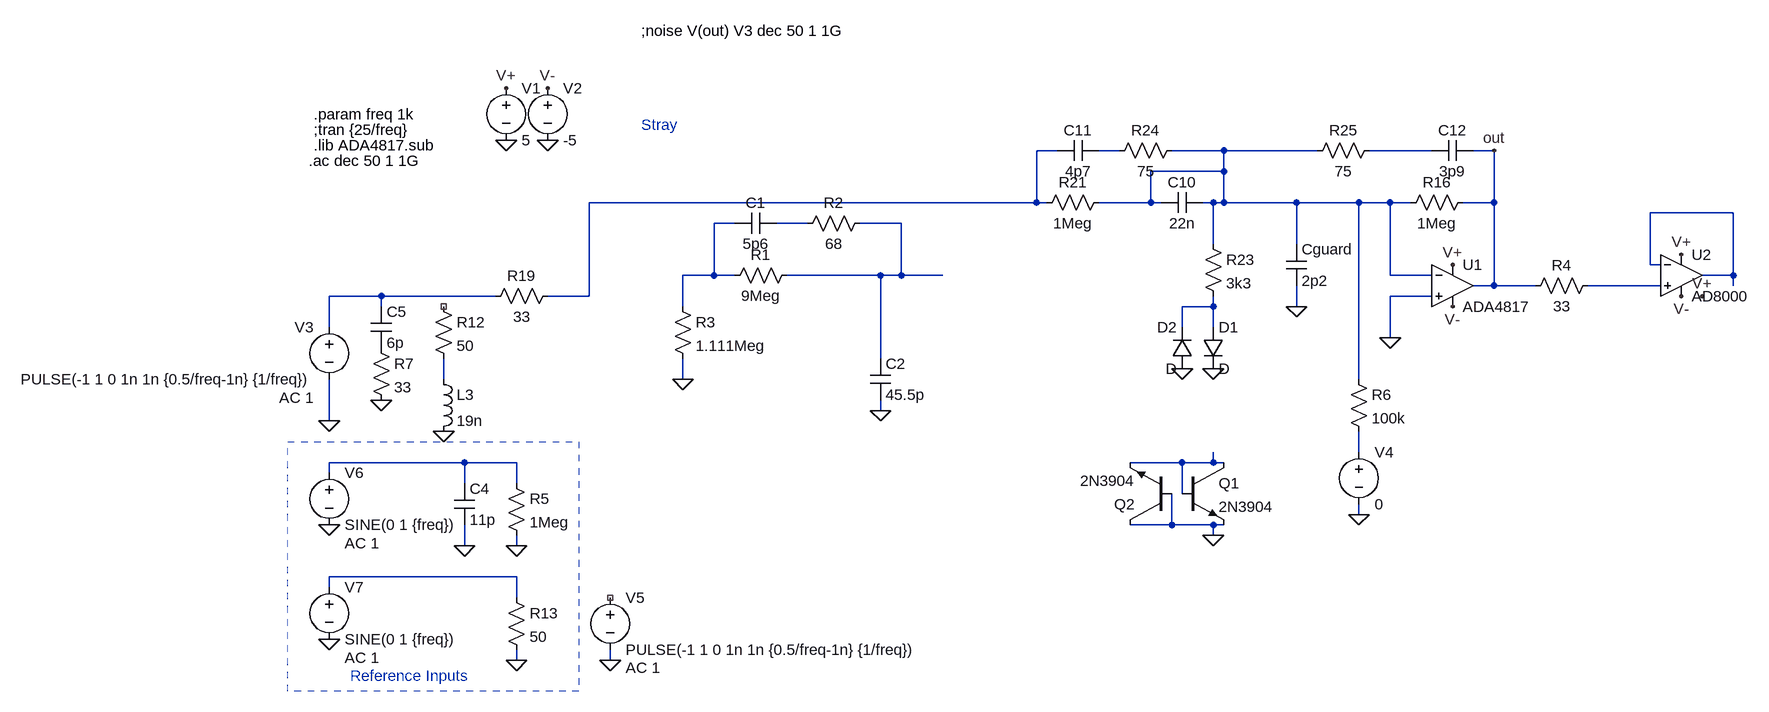
[diagram p0: schematic input-inverting.asc]
input-inverting.asc, the LTspice schematic file:
Version 4
SHEET 1 2588 772
WIRE 976 -208 944 -208
WIRE 1072 -208 1040 -208
WIRE 1232 -208 1152 -208
WIRE 1376 -208 1232 -208
WIRE 1552 -208 1456 -208
WIRE 1648 -208 1616 -208
WIRE 1232 -176 1232 -208
WIRE 1232 -176 1120 -176
WIRE 944 -128 944 -208
WIRE 944 -128 256 -128
WIRE 960 -128 944 -128
WIRE 1120 -128 1120 -176
WIRE 1120 -128 1040 -128
WIRE 1136 -128 1120 -128
WIRE 1216 -128 1200 -128
WIRE 1232 -128 1232 -176
WIRE 1232 -128 1216 -128
WIRE 1344 -128 1232 -128
WIRE 1440 -128 1344 -128
WIRE 1488 -128 1440 -128
WIRE 1520 -128 1488 -128
WIRE 1648 -128 1648 -208
WIRE 1648 -128 1600 -128
WIRE 2016 -112 1888 -112
WIRE 480 -96 448 -96
WIRE 592 -96 544 -96
WIRE 736 -96 672 -96
WIRE 1216 -64 1216 -128
WIRE 1344 -64 1344 -128
WIRE 1888 -32 1888 -112
WIRE 1904 -32 1888 -32
WIRE 448 -16 448 -96
WIRE 448 -16 400 -16
WIRE 480 -16 448 -16
WIRE 704 -16 560 -16
WIRE 736 -16 736 -96
WIRE 736 -16 704 -16
WIRE 800 -16 736 -16
WIRE 1488 -16 1488 -128
WIRE 1552 -16 1488 -16
WIRE 2016 -16 2016 -112
WIRE 2016 -16 1968 -16
WIRE 1648 0 1648 -128
WIRE 1648 0 1616 0
WIRE 1712 0 1648 0
WIRE 1904 0 1792 0
WIRE 2016 0 2016 -16
WIRE -64 16 -144 16
WIRE 112 16 -64 16
WIRE 256 16 256 -128
WIRE 256 16 192 16
WIRE 1552 16 1488 16
WIRE -64 32 -64 16
WIRE 400 32 400 -16
WIRE 1216 32 1216 16
WIRE 1216 32 1168 32
WIRE 1344 32 1344 0
WIRE -144 64 -144 16
WIRE 1168 64 1168 32
WIRE 1216 64 1216 32
WIRE 1488 80 1488 16
WIRE 704 112 704 -16
WIRE 32 144 32 112
WIRE 400 144 400 112
WIRE 1440 144 1440 -128
WIRE 704 192 704 176
WIRE -144 208 -144 144
WIRE 1440 256 1440 224
WIRE 64 272 -144 272
WIRE 144 272 64 272
WIRE 1168 272 1088 272
WIRE 1216 272 1216 256
WIRE 1216 272 1168 272
WIRE 1232 272 1216 272
WIRE -144 288 -144 272
WIRE 64 304 64 272
WIRE 144 304 144 272
WIRE 1168 320 1168 272
WIRE 1440 352 1440 336
WIRE 1152 368 1152 320
WIRE 1152 368 1088 368
WIRE 1216 368 1152 368
WIRE 1232 368 1216 368
WIRE 1216 384 1216 368
WIRE 64 400 64 368
WIRE 144 400 144 384
WIRE 144 448 -144 448
WIRE -144 464 -144 448
WIRE 144 480 144 448
WIRE 144 576 144 560
WIRE 288 576 288 560
FLAG 128 -224 0
FLAG 128 -304 V+
FLAG 1584 -32 V+
FLAG 192 -224 0
FLAG 192 -304 V-
FLAG 1584 32 V-
FLAG -144 208 0
FLAG -144 368 0
FLAG 64 400 0
FLAG 144 400 0
FLAG -64 176 0
FLAG -144 544 0
FLAG 144 576 0
FLAG 32 224 0
FLAG 1936 -48 V+
FLAG 1968 16 V+
FLAG 1936 16 V-
FLAG 288 576 0
FLAG 1488 80 0
FLAG 1216 384 0
FLAG 704 192 0
FLAG 400 144 0
FLAG 1440 352 0
FLAG 1344 32 0
FLAG 1648 -208 out
FLAG 1168 128 0
FLAG 1216 128 0
SYMBOL Opamps\\opamp2 1584 -64 R0
SYMATTR InstName U1
SYMATTR Value ADA4817
SYMBOL voltage 128 -320 R0
WINDOW 123 0 0 Left 2
WINDOW 39 0 0 Left 2
SYMATTR InstName V1
SYMATTR Value 5
SYMBOL voltage 192 -320 R0
WINDOW 123 0 0 Left 2
WINDOW 39 0 0 Left 2
SYMATTR InstName V2
SYMATTR Value -5
SYMBOL voltage 288 464 R0
WINDOW 123 24 124 Left 2
WINDOW 39 0 0 Left 2
SYMATTR Value2 AC 1
SYMATTR InstName V5
SYMATTR Value PULSE(-1 1 0 1n 1n {0.5/freq-1n} {1/freq})
SYMBOL voltage -144 272 R0
WINDOW 123 24 124 Left 2
WINDOW 39 0 0 Left 2
SYMATTR Value2 AC 1
SYMATTR InstName V6
SYMATTR Value SINE(0 1 {freq})
SYMBOL cap 48 304 R0
SYMATTR InstName C4
SYMATTR Value 11p
SYMBOL res 128 288 R0
SYMATTR InstName R5
SYMATTR Value 1Meg
SYMBOL cap -80 32 R0
SYMATTR InstName C5
SYMATTR Value 6p
SYMBOL res -80 80 R0
SYMATTR InstName R7
SYMATTR Value 33
SYMBOL res 16 16 R0
SYMATTR InstName R12
SYMATTR Value 50
SYMBOL voltage -144 448 R0
WINDOW 123 24 124 Left 2
WINDOW 39 0 0 Left 2
SYMATTR Value2 AC 1
SYMATTR InstName V7
SYMATTR Value SINE(0 1 {freq})
SYMBOL res 128 464 R0
SYMATTR InstName R13
SYMATTR Value 50
SYMBOL ind 16 128 R0
SYMATTR InstName L3
SYMATTR Value 19n
SYMBOL res 1808 -16 R90
WINDOW 0 0 56 VBottom 2
WINDOW 3 32 56 VTop 2
SYMATTR InstName R4
SYMATTR Value 33
SYMBOL Opamps\\AD\\AD8000 1936 -80 R0
SYMATTR InstName U2
SYMBOL voltage -144 48 M0
WINDOW 123 24 124 Left 2
WINDOW 39 0 0 Left 2
SYMATTR Value2 AC 1
SYMATTR InstName V3
SYMATTR Value PULSE(-1 1 0 1n 1n {0.5/freq-1n} {1/freq})
SYMBOL cap 1200 -144 R90
WINDOW 0 0 32 VBottom 2
WINDOW 3 32 32 VTop 2
SYMATTR InstName C10
SYMATTR Value 22n
SYMBOL res 208 0 R90
WINDOW 0 0 56 VBottom 2
WINDOW 3 32 56 VTop 2
SYMATTR InstName R19
SYMATTR Value 33
SYMBOL res 1616 -144 R90
WINDOW 0 0 56 VBottom 2
WINDOW 3 32 56 VTop 2
SYMATTR InstName R16
SYMATTR Value 1Meg
SYMBOL res 1056 -144 R90
WINDOW 0 0 56 VBottom 2
WINDOW 3 32 56 VTop 2
SYMATTR InstName R21
SYMATTR Value 1Meg
SYMBOL cap 1040 -224 R90
WINDOW 0 0 32 VBottom 2
WINDOW 3 32 32 VTop 2
SYMATTR InstName C11
SYMATTR Value 4p7
SYMBOL cap 1616 -224 R90
WINDOW 0 0 32 VBottom 2
WINDOW 3 32 32 VTop 2
SYMATTR InstName C12
SYMATTR Value 3p9
SYMBOL res 1200 -80 R0
SYMATTR InstName R23
SYMATTR Value 3k3
SYMBOL npn 1168 272 R0
SYMATTR InstName Q1
SYMATTR Value 2N3904
SYMBOL npn 1152 368 R180
SYMATTR InstName Q2
SYMATTR Value 2N3904
SYMBOL res 1168 -224 R90
WINDOW 0 0 56 VBottom 2
WINDOW 3 32 56 VTop 2
SYMATTR InstName R24
SYMATTR Value 75
SYMBOL res 1472 -224 R90
WINDOW 0 0 56 VBottom 2
WINDOW 3 32 56 VTop 2
SYMATTR InstName R25
SYMATTR Value 75
SYMBOL res 576 -32 R90
WINDOW 0 0 56 VBottom 2
WINDOW 3 32 56 VTop 2
SYMATTR InstName R1
SYMATTR Value 9Meg
SYMBOL cap 544 -112 R90
WINDOW 0 0 32 VBottom 2
WINDOW 3 32 32 VTop 2
SYMATTR InstName C1
SYMATTR Value 5p6
SYMBOL res 688 -112 R90
WINDOW 0 0 56 VBottom 2
WINDOW 3 32 56 VTop 2
SYMATTR InstName R2
SYMATTR Value 68
SYMBOL cap 688 112 R0
SYMATTR InstName C2
SYMATTR Value 45.5p
SYMBOL res 384 16 R0
SYMATTR InstName R3
SYMATTR Value 1.111Meg
SYMBOL res 1424 128 R0
SYMATTR InstName R6
SYMATTR Value 100k
SYMBOL voltage 1440 240 R0
WINDOW 123 0 0 Left 2
WINDOW 39 0 0 Left 2
SYMATTR InstName V4
SYMATTR Value 0
SYMBOL cap 1328 -64 R0
SYMATTR InstName Cguard
SYMATTR Value 2p2
SYMBOL diode 1200 64 R0
SYMATTR InstName D1
SYMBOL diode 1184 128 R180
WINDOW 0 24 64 Left 2
WINDOW 3 24 0 Left 2
SYMATTR InstName D2
TEXT -168 -264 Left 2 !.param freq 1k
TEXT -168 -240 Left 2 !;tran {25/freq}
TEXT -168 -216 Left 2 !.lib ADA4817.sub
TEXT -176 -192 Left 2 !.ac dec 50 1 1G
TEXT -112 600 Left 2 ;Reference Inputs
TEXT 336 -248 Left 2 ;Stray
TEXT 336 -392 Left 2 !;noise V(out) V3 dec 50 1 1G
RECTANGLE Normal 240 624 -208 240 2

The netlist it stands for:
* input-inverting.asc
XU1 0 N003 V+ V- out ADA4817  ; pins In+ In- V+ V- OUT
V1 V+ 0 5
V2 V- 0 -5
V5 NC_01 0 PULSE(-1 1 0 1n 1n {0.5/freq-1n} {1/freq}) AC 1
V6 N014 0 SINE(0 1 {freq}) AC 1
C4 N014 0 11p
R5 N014 0 1Meg
C5 N010 P001 6p
R7 P001 0 33
R12 NC_02 N012 50
V7 N016 0 SINE(0 1 {freq}) AC 1
R13 N016 0 50
L3 N012 0 19n
R4 N009 out 33
XU2 N009 N005 V+ V- N005 AD8000  ; pins In+ In- V+ V- OUT
V3 N010 0 PULSE(-1 1 0 1n 1n {0.5/freq-1n} {1/freq}) AC 1
C10 N003 N003 22n
R19 N001 N010 33
R16 out N003 1Meg
R21 N003 N001 1Meg
C11 N002 N001 4p7
C12 out N004 3p9
R23 N003 N011 3k3
Q1 N015 N015 0 0 2N3904
Q2 0 0 N015 0 2N3904
R24 N003 N002 75
R25 N004 N003 75
R1 N008 N006 9Meg
C1 N007 N006 5p6
R2 N008 N007 68
C2 N008 0 45.5p
R3 N006 0 1.111Meg
R6 N003 N013 100k
V4 N013 0 0
Cguard N003 0 2p2
D1 N011 0 D
D2 0 N011 D
.model D D
.lib standard.dio
.model NPN NPN
.model PNP PNP
.lib standard.bjt
.param freq 1k
;tran {25/freq}
.lib ADA4817.sub
.ac dec 50 1 1G
* Reference Inputs
* Stray
;noise V(out) V3 dec 50 1 1G
.backanno
.end